# EAGLE design MKR1kDMX (EAGLE 7.5.0)
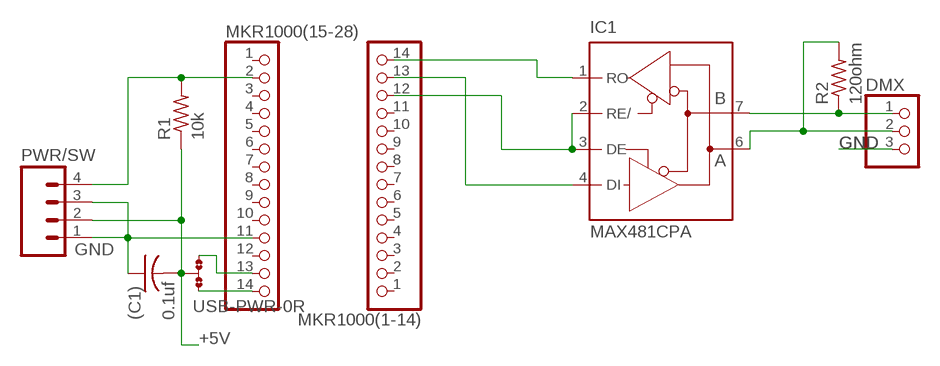
[diagram p0: schematic, sheet 1]

## Parts
(C1)  0.1uf  C-US050-025X075  [C050-025X075]
DMX  PINHD-1X3  [1X03]
IC1  MAX481CPA  [DIL08]
MKR1000(1-14)  PINHD-1X14  [1X14]
MKR1000(15-28)  PINHD-1X14  [1X14]
PWR/SW  1X04_HEADER"  [1X04_HEADER]
R1  10k  RESISTOR1/6WATT  [RESISTOR]
R2  120ohm  RESISTOR1/6WATT  [RESISTOR]
USB-PWR  PWR-IN  0R-JUMPB  [B0R-JMP]

## Nets
+5V: (C1).2 PWR/SW.2 R1.1 USB-PWR.2
GND: (C1).1 DMX.3 MKR1000(15-28).11 PWR/SW.1 PWR/SW.3
N$1: DMX.1 IC1.7(B) R2.1
N$2: DMX.2 IC1.6(A) R2.2
N$3: IC1.4(DI) MKR1000(1-14).13
N$4: IC1.2(RE/) IC1.3(DE) MKR1000(1-14).12
N$5: IC1.1(RO) MKR1000(1-14).14
N$6: MKR1000(15-28).2 PWR/SW.4 R1.2
N$8: MKR1000(15-28).13 USB-PWR.3
N$10: MKR1000(15-28).14 USB-PWR.1
Unconnected: MKR1000(1-14).1 MKR1000(1-14).2 MKR1000(1-14).3 MKR1000(1-14).4 MKR1000(1-14).5 MKR1000(1-14).6 MKR1000(1-14).7 MKR1000(1-14).8 MKR1000(1-14).9 MKR1000(1-14).10 MKR1000(1-14).11 MKR1000(15-28).1 MKR1000(15-28).3 MKR1000(15-28).4 MKR1000(15-28).5 MKR1000(15-28).6 MKR1000(15-28).7 MKR1000(15-28).8 MKR1000(15-28).9 MKR1000(15-28).10 MKR1000(15-28).12

## Power pins joined to a net without a drawn wire
+5V: IC1.8(VCC)
GND: IC1.5(GND)

## Library data of the parts
(C1) = resistor:C-US: CAPACITOR, American symbol
DMX = adafruit:PINHD-1X3: PIN HEADER
IC1 = maxim:MAX481CPA: RS485 TRANSEIVER; MPN: MAX481CPA+; OC_FARNELL: unknown; OC_NEWARK: 99K3445
MKR1000(1-14) MKR1000(15-28) = adafruit:PINHD-1X14: PIN HEADER
PWR/SW = RBBB:1X04_HEADER: Header 4 Standard 4-pin 0.1" header. Use with straight break away headers (SKU : PRT-00116), right angle break away headers (PRT-00553), swiss pins (PRT-00743), machine pins (PRT-00117), and female headers (PRT-00115). Molex polarized connector foot print use with SKU : PRT-08231 with associated crimp pins and housings.
R1 R2 = RBBB:RESISTOR: RESISTOR, American symbol
USB-PWR = jump-0r-smd:0R-JUMP: SMD 0R 0805 Jumper

## Board
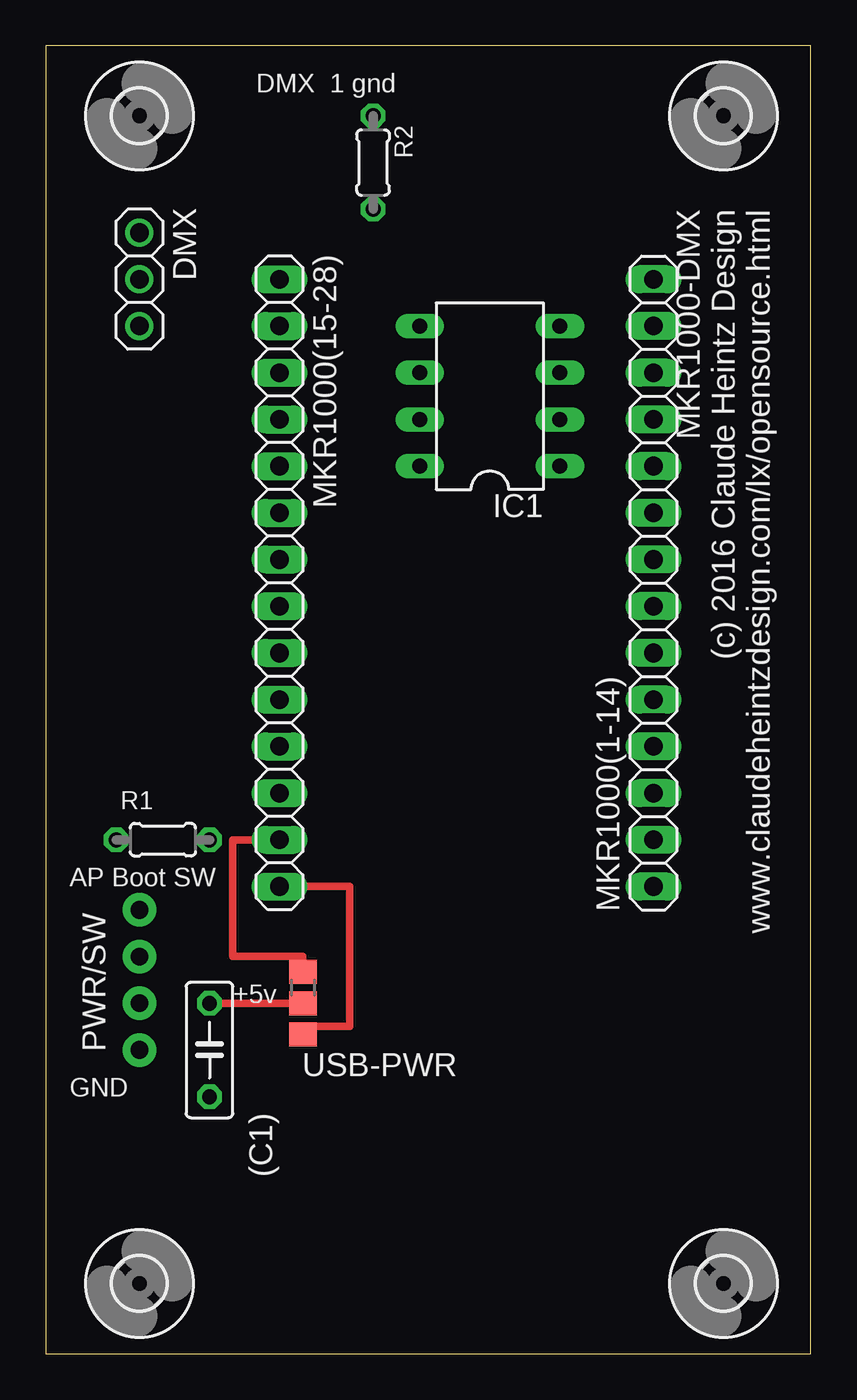
[diagram p1: board, top side]
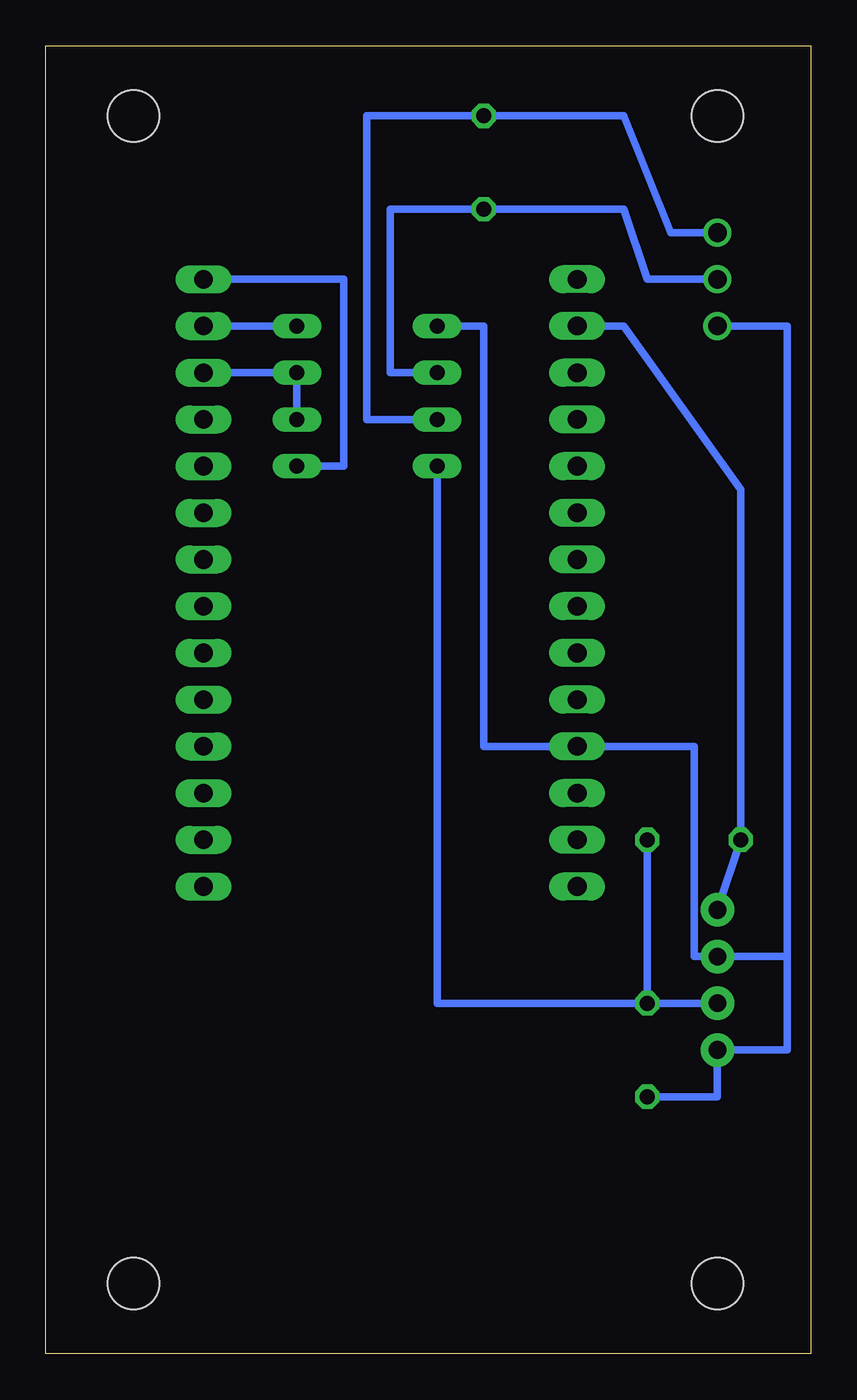
[diagram p2: board, bottom side, seen from below]

Size 41.58 x 71.11 mm. Coordinates in mm from the lower left corner, seen from the top.
Outline: 0,0 41.58,0 41.58,71.11 0,71.11 0,0
Copper layers (1*16): Top 0.035mm / dielectric 1.5mm / Bottom 0.035mm
Design rules "SeeedStudio_2layer_DRU_no_angle_20140221": minimum track width 6mil, minimum drill 12mil, track to track 6mil, track to pad 6mil, pad to pad 6mil, via to via 6mil, smd to smd 0mil, copper to edge 10mil, drill to drill 10mil, minimum pad ring 10mil, minimum via ring 6mil, stop-mask expansion 2mil, vias tented up to drill 100mil, thermal gap 10mil

### Footprints (pad centres in the part's own frame; a part is rotated, then mirrored left to right if it is on the bottom)
C050-025X075 = drill 0.813 octagon: 1 -2.54,0; 2 2.54,0
1X03 = drill 1.016: 1 -2.54,0; 2 0,0; 3 2.54,0
DIL08 = drill 0.813 long: 1 -3.81,-3.81; 2 -1.27,-3.81; 3 1.27,-3.81; 4 3.81,-3.81; 5 3.81,3.81; 6 1.27,3.81; 7 -1.27,3.81; 8 -3.81,3.81
1X14 = drill 1.016 long: 1 -16.51,0; 2 -13.97,0; 3 -11.43,0; 4 -8.89,0; 5 -6.35,0; 6 -3.81,0; 7 -1.27,0; 8 1.27,0; 9 3.81,0; 10 6.35,0; 11 8.89,0; 12 11.43,0; 13 13.97,0; 14 16.51,0
1X04_HEADER = drill 0.965 pad 1.829: 1 0,0; 2 2.54,0; 3 5.08,0; 4 7.62,0
RESISTOR = drill 0.813 octagon: 1 -2.54,0; 2 2.54,0
2,8 = hole 2.8: 0,0
B0R-JMP = smd 1.5 x 1.3: 1 0,1.7; 2 0,0; 3 0,-1.7

### Placement (x,y rotation side)
(C1)  8.89,16.51 90 top
DMX  5.08,58.42 270 top
IC1  24.13,52.07 90 top
MKR1000(1-14)  33.02,41.91 90 top
MKR1000(15-28)  12.7,41.91 270 top
PWR/SW  5.08,16.51 90 top
R1  6.35,27.94 180 top
R2  17.78,64.77 270 top
U$3  [2,8]  5.08,67.31 0 top
U$4  [2,8]  36.83,67.31 0 top
U$5  [2,8]  5.08,3.81 0 top
U$6  [2,8]  36.83,3.81 0 top
USB-PWR  13.97,19.05 180 top

### Tracks (layer width: path | path; a pad name or v marks a point on that pad's centre or on a via)
+5V
  Top 0.406: USB-PWR.2 (C1).2
  Bottom 0.406: R1.1 (C1).2 | PWR/SW.2 (C1).2 | IC1.8 20.32,19.05 (C1).2
GND
  Bottom 0.406: IC1.5 17.78,55.88 17.78,33.02 MKR1000(15-28).11 6.35,33.02 6.35,21.59 PWR/SW.3 1.27,21.59 | 1.27,21.59 1.27,16.51 PWR/SW.1 5.08,13.97 (C1).1 | DMX.3 1.27,55.88 1.27,21.59
N$1
  Bottom 0.406: IC1.7 24.13,50.8 24.13,67.31 R2.1 10.16,67.31 7.62,60.96 DMX.1
N$2
  Bottom 0.406: IC1.6 22.86,53.34 22.86,62.23 R2.2 10.16,62.23 8.89,58.42 DMX.2
N$3
  Bottom 0.406: IC1.4 MKR1000(1-14).13
N$4
  Bottom 0.406: IC1.2 IC1.3 MKR1000(1-14).12
N$5
  Bottom 0.406: IC1.1 25.4,48.26 25.4,58.42 MKR1000(1-14).14
N$6
  Bottom 0.406: MKR1000(15-28).2 10.16,55.88 3.81,46.99 R1.2 PWR/SW.4
N$8
  Top 0.406: MKR1000(15-28).13 10.16,27.94 10.16,21.59 13.97,21.59 USB-PWR.3
N$10
  Top 0.406: MKR1000(15-28).14 16.51,25.4 16.51,17.78 13.97,17.78 USB-PWR.1

### Text on the board
tNames: DMX 1 gnd | MKR1000-DMX / (c) 2016 Claude Heintz Design / www.claudeheintzdesign.com/lx/opensource.html | AP Boot SW | +5v | GND